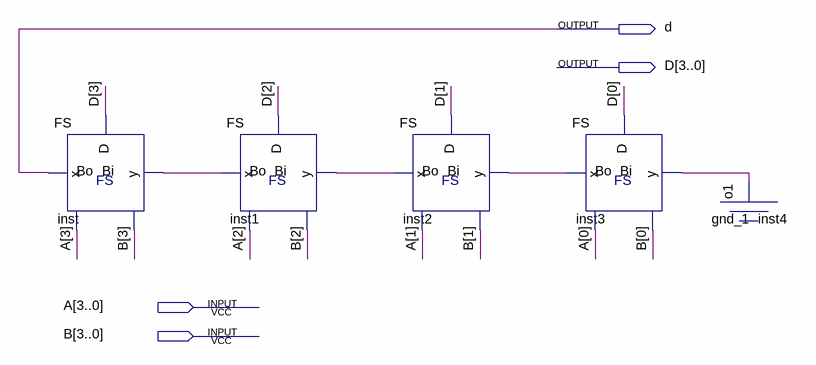
[diagram p0: schematic sheet]
// Quartus schematic FS4.bdf as structural Verilog: 5 symbols, 4 pins
module FS4 (
  input  [3:0] A,
  input  [3:0] B,
  output D_1bit,
  output [3:0] D
);

  wire inst1_bo, inst2_bo, inst3_bo, inst4_o1;

  FS inst (.Bi(inst1_bo), .x(A[3]), .y(B[3]), .D(D[3]), .Bo(D_1bit));
  FS inst1 (.Bi(inst2_bo), .x(A[2]), .y(B[2]), .D(D[2]), .Bo(inst1_bo));
  FS inst2 (.Bi(inst3_bo), .x(A[1]), .y(B[1]), .D(D[1]), .Bo(inst2_bo));
  FS inst3 (.Bi(inst4_o1), .x(A[0]), .y(B[0]), .D(D[0]), .Bo(inst3_bo));
  gnd_1 inst4 (.o1(inst4_o1));
endmodule
